# EAGLE design rapidshark-main-breakout-top-mk-1.3 (EAGLE 6.5.0)
AUTHOR: sean@yak.net
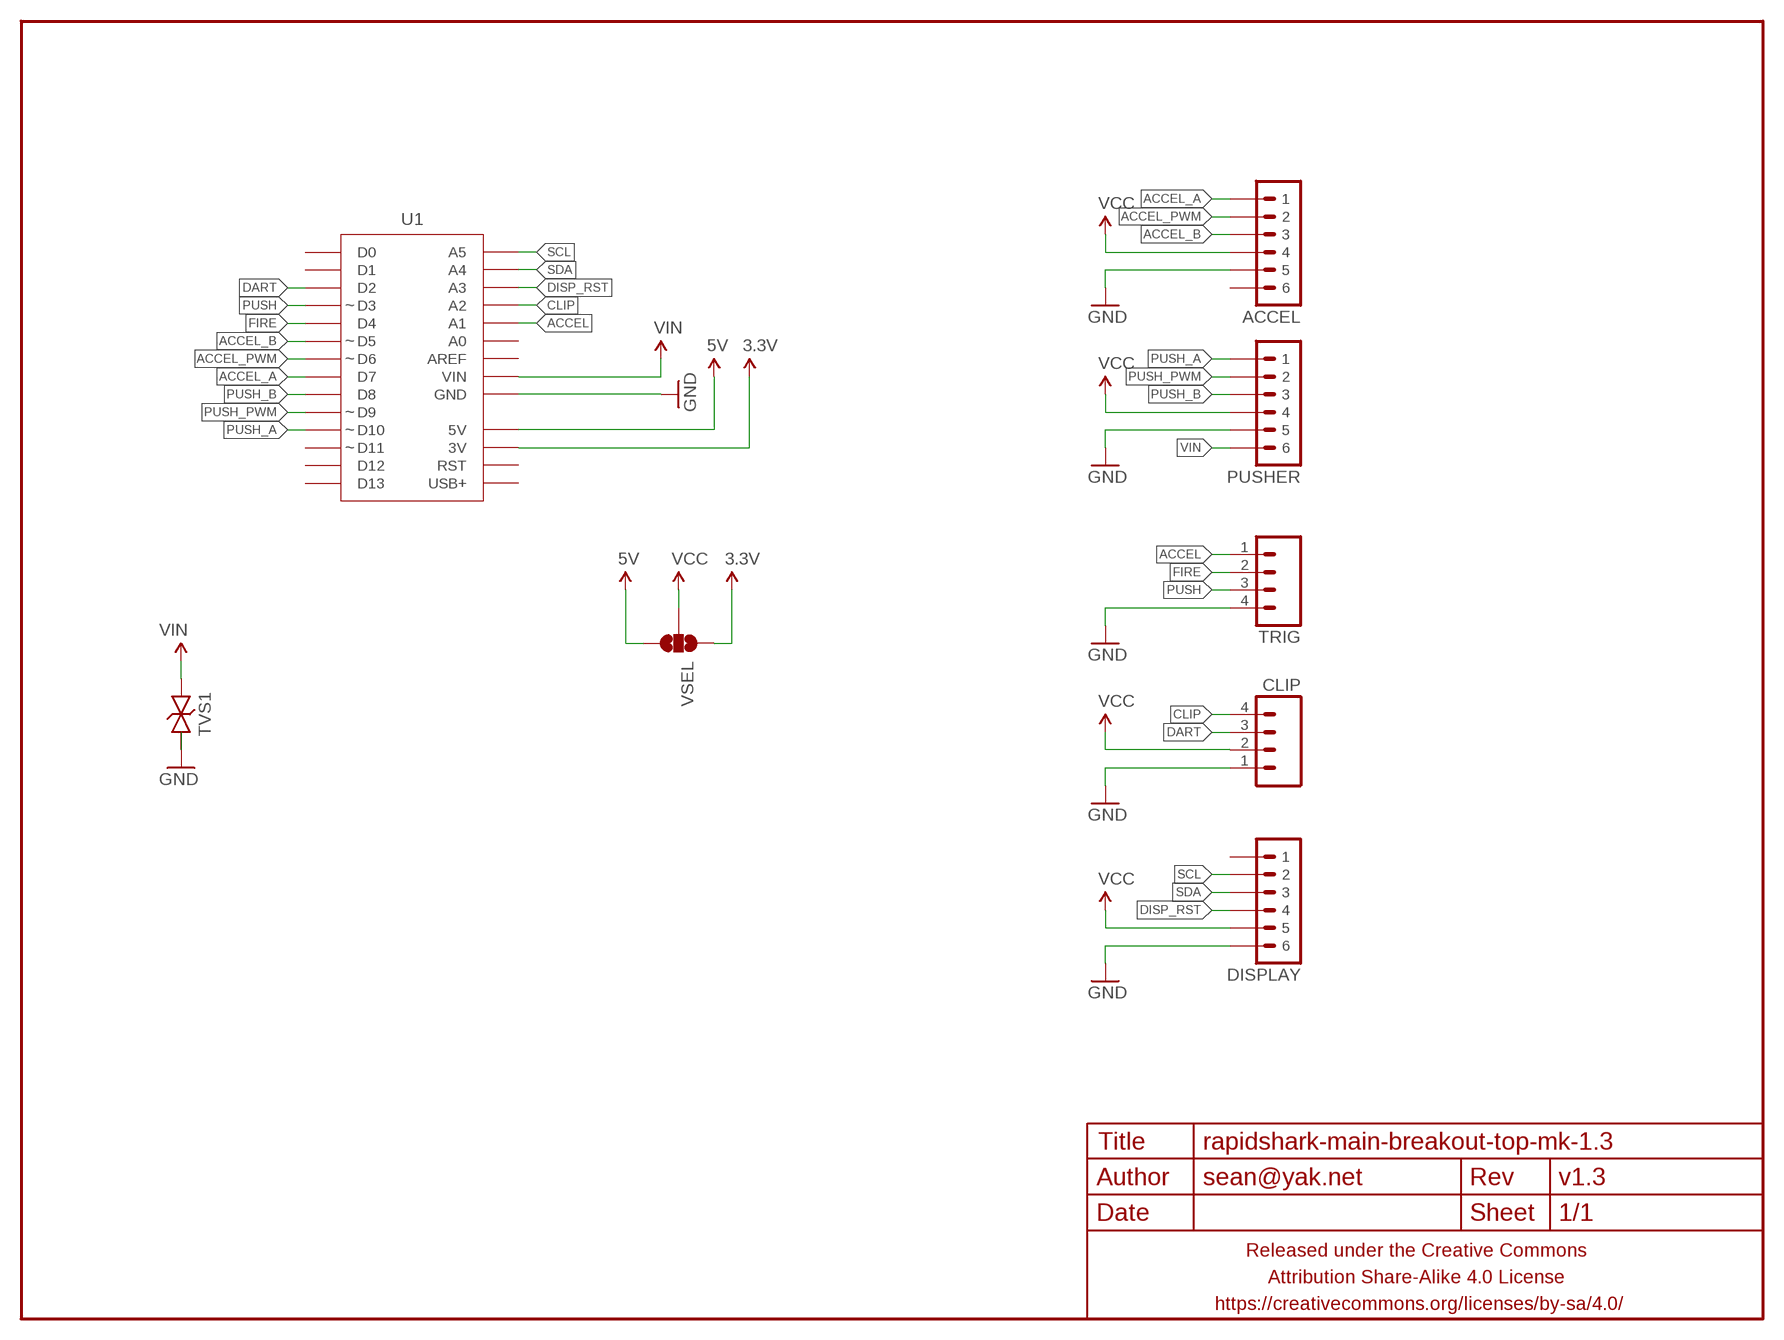
[diagram p0: schematic, sheet 1]

## Parts
ACCEL  M06JST-PH-PTH-VERT  [JST-6-PH-VERT-PTH]
CLIP  M04JST-PTH-VERT  [JST-4-PH-VERT-PTH]
DISPLAY  M06JST-PH-PTH-VERT  [JST-6-PH-VERT-PTH]
FRAME1  FRAME-LETTERNO_PACKAGE  [DUMMY]
PUSHER  M06JST-PH-PTH-VERT  [JST-6-PH-VERT-PTH]
TRIG  M04JST-PTH-VERT  [JST-4-PH-VERT-PTH]
TVS1  TVSDO-41-8.89MM  [DO-41-TVS-BI-8.89MM]
U1  ADAFRUIT_METRO_MININOSILK-ABMBI  [ADAFRUIT_METRO_MINI_FLIPPED]
VSEL  JUMPER-PAD-3-NOFULL_BOX_SILK  [PAD-JUMPER-3-NO_YES_SILK_FULL_BOX]

## Nets
3.3V: U1.17(3V) VSEL.1
5V: U1.18(5V) VSEL.3
ACCEL: TRIG.1 U1.24(A1)
ACCEL_A: ACCEL.1 U1.8(D7)
ACCEL_B: ACCEL.3 U1.6(D5)
ACCEL_PWM: ACCEL.2 U1.7(D6)
CLIP: CLIP.4 U1.25(A2)
DART: CLIP.3 U1.3(D2)
DISP_RST: DISPLAY.4 U1.26(A3)
FIRE: TRIG.2 U1.5(D4)
GND: ACCEL.5 CLIP.1 DISPLAY.6 PUSHER.5 TRIG.4 TVS1.P$1 U1.19(GND) U1.20(GND)
PUSH: TRIG.3 U1.4(D3)
PUSH_A: PUSHER.1 U1.11(D10)
PUSH_B: PUSHER.3 U1.9(D8)
PUSH_PWM: PUSHER.2 U1.10(D9)
SCL: DISPLAY.2 U1.28(A5)
SDA: DISPLAY.3 U1.27(A4)
VCC: ACCEL.4 CLIP.2 DISPLAY.5 PUSHER.4 VSEL.2
VIN: PUSHER.6 TVS1.P$2 U1.21(VIN)
Unconnected: ACCEL.6 DISPLAY.1 U1.1(D0) U1.2(D1) U1.12(D11) U1.13(D12) U1.14(D13) U1.15(USB+) U1.16(RST) U1.22(AREF) U1.23(A0)

## Library data of the parts
ACCEL DISPLAY PUSHER = A_butts:M06: Header 6 Standard 6-pin 0.1" header. Use with straight break away headers (SKU : PRT-00116), right angle break away headers (PRT-00553), swiss pins (PRT-00743), machine pins (PRT-00117), and female headers (PRT-00115). Molex polarized connector foot print use with SKU : PRT-08094 with associated crimp pins and housings. NOTES ON THE VARIANTS LOCK and LOCK_LONGPADS... This footprint was designed to help hold the alignment of a through-hole component (i.e. 6-pin header) while soldering it into place. You may notice that each hole has been shifted either up or down by 0.005 of an inch from it's more standard position (which is a perfectly straight line). This slight alteration caused the pins (the squares in the middle) to touch the edges of the holes. Because they are alternating, it causes a "brace" to hold the component in place. 0.005 has proven to be the perfect amount of "off-center" position when using our standard breakaway headers. Although looks a little odd when you look at the bare footprint, once you have a header in there, the alteration is very hard to notice. Also,if you push a header all the way into place, it is covered up entirely on the bottom side. This idea of altering the position of holes to aid alignment will be further integrated into the Sparkfun Library for other footprints. It can help hold any component with 3 or more connection pins.
CLIP TRIG = A_butts:M04: Header 4 Standard 4-pin 0.1" header. Use with straight break away headers (SKU : PRT-00116), right angle break away headers (PRT-00553), swiss pins (PRT-00743), machine pins (PRT-00117), and female headers (PRT-00115). Molex polarized connector foot print use with SKU : PRT-08231 with associated crimp pins and housings. 1MM SMD Version SKU: PRT-10208
FRAME1 = A_butts:FRAME-LETTER: Schematic Frame Standard 8.5x11 US Letter frame; DESIGNER: sean@yak.net; VERSION: v1.3
TVS1 = A_butts:TVS: Transient voltage suppressor- prevents ESD on inputs. Ignore package description- MBRA140 is NOT this type of part!!!
U1 = A_butts:ADAFRUIT_METRO_MINI
VSEL = A_butts:JUMPER-PAD-3-NO

## Board
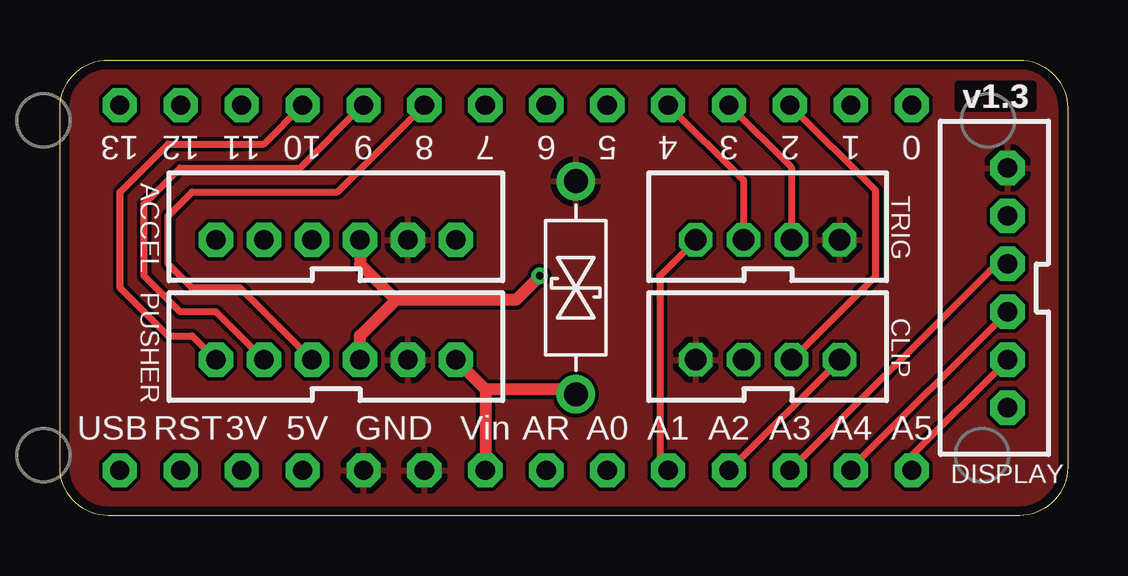
[diagram p1: board, top side]
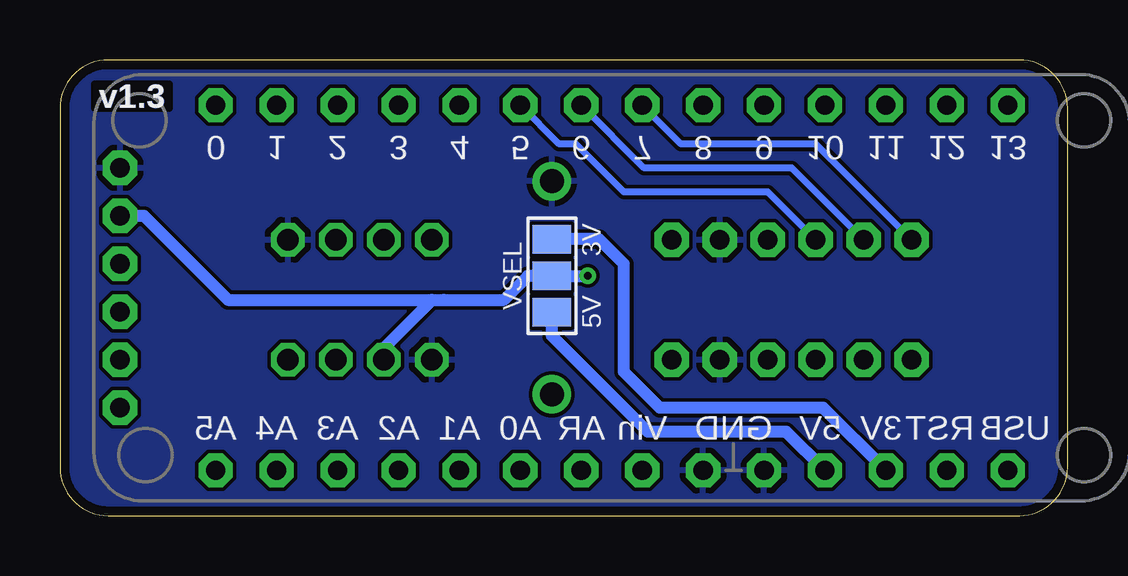
[diagram p2: board, bottom side, seen from below]

Size 42 x 19 mm. Coordinates in mm from the lower left corner, seen from the top.
Outline: 2,19 40,19 arc-90 42,17 42,2 arc-90 40,0 2,0 arc-90 0,2 0,17 arc-90 2,19
Copper layers (1*16): Top 0.0356mm / dielectric 1.5011mm / Bottom 0.0356mm
Design rules "LaenPCBOrder_2": minimum track width 6mil, minimum drill 13mil, track to track 6mil, track to pad 6mil, pad to pad 6mil, via to via 6mil, smd to smd 6mil, copper to edge 15mil, drill to drill 6mil, minimum pad ring 7mil, minimum via ring 7mil, stop-mask expansion 3mil, vias tented up to drill 20mil, thermal gap 10mil

### Footprints (pad centres in the part's own frame; a part is rotated, then mirrored left to right if it is on the bottom)
JST-6-PH-VERT-PTH = drill 0.8 pad 1.422 octagon: 1 -5,0; 2 -3,0; 3 -1,0; 4 1,0; 5 3,0; 6 5,0
JST-4-PH-VERT-PTH = drill 0.9 pad 1.4 octagon: 1 0,0; 2 2,0; 3 4,0; 4 6,0
DO-41-TVS-BI-8.89MM = drill 1 pad 1.6: P$1 -4.445,0; P$2 4.445,0
ADAFRUIT_METRO_MINI_FLIPPED = drill 0.8 pad 1.422 octagon: 1 16.51,7.62; 2 13.97,7.62; 3 11.43,7.62; 4 8.89,7.62; 5 6.35,7.62; 6 3.81,7.62; 7 1.27,7.62; 8 -1.27,7.62; 9 -3.81,7.62; 10 -6.35,7.62; 11 -8.89,7.62; 12 -11.43,7.62; 13 -13.97,7.62; 14 -16.51,7.62; 15 -16.51,-7.62; 16 -13.97,-7.62; 17 -11.43,-7.62; 18 -8.89,-7.62; 19 -6.35,-7.62; 20 -3.81,-7.62; 21 -1.27,-7.62; 22 1.27,-7.62; 23 3.81,-7.62; 24 6.35,-7.62; 25 8.89,-7.62; 26 11.43,-7.62; 27 13.97,-7.62; 28 16.51,-7.62
PAD-JUMPER-3-NO_YES_SILK_FULL_BOX = smd 1.2 x 1.6: 1 -1.524,0; 2 0,0; 3 1.524,0

### Placement (x,y rotation side)
ACCEL  11.5,11.5 0 top
CLIP  26.5,6.5 0 top
DISPLAY  39.5,9.5 90 top
FRAME1  0,0 270 bottom
PUSHER  11.5,6.5 0 top
TRIG  26.5,11.5 0 top
TVS1  21.5,9.5 270 top
U1  19,9.5 0 top
VSEL  21.5,10 270 bottom

### Tracks (layer width: path | path; a pad name or v marks a point on that pad's centre or on a via)
3.3V
  Bottom 0.5: U1.17 10.19,4.5 17,4.5 18.5,6 18.5,10.5 19.52,11.52 VSEL.1
5V
  Bottom 0.5: U1.18 11.73,3.5 17.5,3.5 21.5,7.5 VSEL.3
ACCEL
  Top 0.3: TRIG.1 25,10 25,2.23 U1.24
ACCEL_A
  Bottom 0.3: ACCEL.1 10.5,15.5 16.11,15.5 U1.8
ACCEL_B
  Bottom 0.3: ACCEL.3 12.5,13.5 18.5,13.5 20.5,15.5 21.19,15.5 U1.6
ACCEL_PWM
  Bottom 0.3: ACCEL.2 11.5,14.5 17.65,14.5 U1.7
CLIP
  Top 0.3: CLIP.4 U1.25
DART
  Top 0.3: CLIP.3 34,10 34,13.55 U1.3
DISP_RST
  Top 0.3: DISPLAY.4 39.05,10.5 U1.26
FIRE
  Top 0.3: TRIG.2 28.5,13.97 U1.5
GND
  pour Top (rank 6): 42,0 0,0 0,19 42,19
  pour Bottom (rank 6): 42,0 0,0 0,19 42,19
PUSH
  Top 0.3: TRIG.3 30.5,14.51 U1.4
PUSH_A
  Top 0.3: U1.11 8.5,15.5 4.5,15.5 2.5,13.5 2.5,9.5 4.5,7.5 5.5,7.5 PUSHER.1
PUSH_B
  Top 0.3: PUSHER.3 7.5,9.5 5.5,9.5 4.5,10.5 4.5,12.5 5.5,13.5 11.57,13.5 U1.9
PUSH_PWM
  Top 0.3: U1.10 12.62,17.12 10,14.5 5,14.5 3.5,13 3.5,10 5,8.5 6.5,8.5 PUSHER.2
SCL
  Top 0.3: DISPLAY.2 35.51,2.51 U1.28
SDA
  Top 0.3: DISPLAY.3 32.97,1.97 U1.27
VCC  (via drill 0.33)
  Top 0.5: PUSHER.4 12.5,7.5 14,9 | ACCEL.4 12.5,10.5 14,9 | v20,10 19,9 14,9
  Bottom 0.5: 26.5,9 35,9 38.5,12.5 DISPLAY.5 | v20,10 VSEL.2 22.5,10 23.5,9 26,9 26.5,9 | CLIP.2 28.5,7 26.5,9
VIN
  Top 0.5: PUSHER.6 17.73,5.27 | 17.73,5.27 U1.21 | TVS1.P$2 21.29,5.27 17.73,5.27

### Text on the board
bPlace: 3V | 5V
Reference: UP | BARREL | BUTT | DOWN
tDocu: TOP layer faces / LEFT of blaster | TOP layer faces / LEFT of blaster
bDocu: BOTTOM layer faces / RIGHT of blaster | BOTTOM layer faces / RIGHT of blaster